# Altium schematic sheet fram_rtc.SchDoc: Triumvi - FRAM/RTC
size Letter; Author: Ye-Sheng Kuo; Revision: 11; SheetNumber: 9; SheetTotal: 10
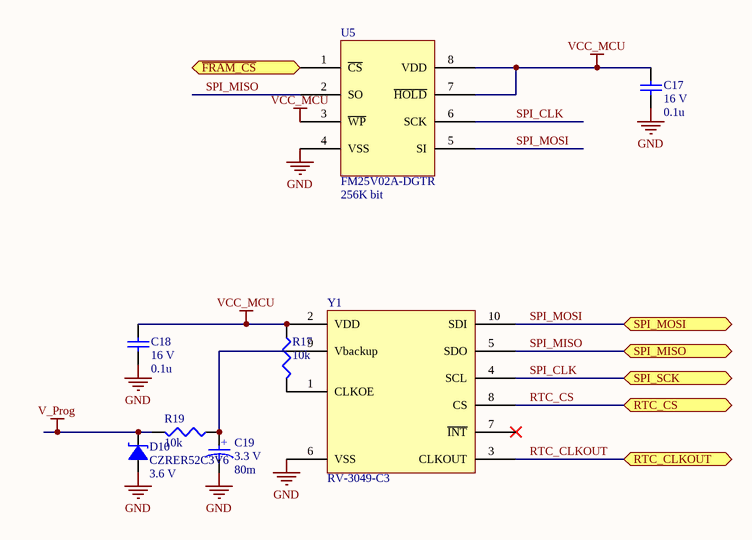
[diagram p0: fram_rtc.SchDoc]

## Parts
C17  voltage rated: 16 V  [0402]  (hidden comment: 0.1u)
C18  voltage rated: 16 V  [0402]  (hidden comment: 0.1u)
C19  voltage rated: 3.3 V  [XH414HG-IV01E]  (hidden comment: 80m)
D10  CZRER52C3V6  Zener Voltage: 3.6 V  [0503/SOD-723F]
R17  10k  [0402]
R19  10k  [0402]
U5  FM25V02A-DGTR  Size: 256K bit  [TDFN-8]
Y1  RV-3049-C3  [RV-3049-C3]

## Ports
RTC_CLKOUT, RTC_CS, SPI_MISO, SPI_MOSI, SPI_SCK, ~{FRAM_CS}

## Nets
GND: C17.2 C18.2 C19.2 D10.1 U5.4(VSS) Y1.6(VSS)
V_Prog: D10.2 R19.1
VCC_MCU: C17.1 C18.1 R17.2 U5.3(~{WP}) U5.7(~{HOLD}) U5.8(VDD) Y1.2(VDD)
~{FRAM_CS}: U5.1(~{CS}) ; port ~{FRAM_CS}
RTC_CLKOUT: Y1.3(CLKOUT) ; port RTC_CLKOUT
RTC_CS: Y1.8(CS) ; port RTC_CS
SPI_CLK: U5.6(SCK) Y1.4(SCL) ; port SPI_SCK
SPI_MISO: U5.2(SO) Y1.5(SDO) ; port SPI_MISO
SPI_MOSI: U5.5(SI) Y1.10(SDI) ; port SPI_MOSI
NetC19_1: C19.1 R19.2 Y1.9(Vbackup)
NetR17_1: R17.1 Y1.1(CLKOE)

Not connected (* = marked no-connect by the designer): Y1 7(~{INT})*

## Notes on the sheet
- Title
- Date:
- Author:
- Revision:
- Sheet
- of
- University of Michigan
- File:
- (in symbol XH414HG-IV01E) +

## Library data of the parts
C17 C18 = GRM155R71C104KA88D: 0.10µF ±10% 16V Ceramic Capacitor X7R 0402; Manufacture: Murata; tolerance: 10%; package: 0402; Supplier 1: Digi-Key; Supplier Part Number 1: 490-3261-1-ND; Value: 0.1u; Temperature Coefficient: X7R; Manufacturer Part Number: GRM155R71C104KA88D
C19 = XH414HG-IV01E: 80mF (EDLC) Supercapacitor 3.3V Coin; Manufacture: Seiko Instruments; Supplier 1: Digi-Key; Supplier Part Number 1: 728-1050-1-ND; Value: 80m; Manufacturer Part Number: XH414HG-IV01E
D10 = CZRER52C3V6: Zener Diode 3.6V 150mW ±5% Surface Mount 0503 (1308 Metric); Manufacturer: Comchip Technology; Forward Voltage @ If: 900 mV @ 10 mA; reverse current: 15 uA @ 1 V; Supplier 1: Digi-Key; Supplier Part Number 1: 641-1232-1-ND; Manufacturer Part Number: CZRER52C3V6; diode type: Zener; power: 150 mW
R17 R19 = CRCW040210K0FKED: RES SMD 10K OHM 1% 1/16W 0402; Manufacturer: Vishay Dale; Temperature Coefficient: 100 ppm/C; Tolerance: 1%; Power: 1/16 W; Supplier 1: Digi-Key; Supplier Part Number 1: 541-10.0KLCT-ND; package: 0402; value: 10k; Manufacturer Part Number: CRCW040210K0FKED
U5 = FM25V02A-DGTR: 256-Kbit (32 K × 8) Serial (SPI) F-RAM; Manufacturer: Cypress Semiconductor; Manufactuere part number: FM25V02A-DGTR; Supplier 1: Digi-Key; Supplier Part Number 1: FM25V02A-DGTR-ND
Y1 = RV-3049-C3: Real Time Clock Module with SPI-Bus